# EasyEDA schematic LcsNodes-Building-Block-Power-Supply-LM2576.json
TITLE: Power supply using LM257x; REV: 1.0; Date: 2022-09-19; Sheet: 1/1; Drawn By: helmut-f; Company: Your Company
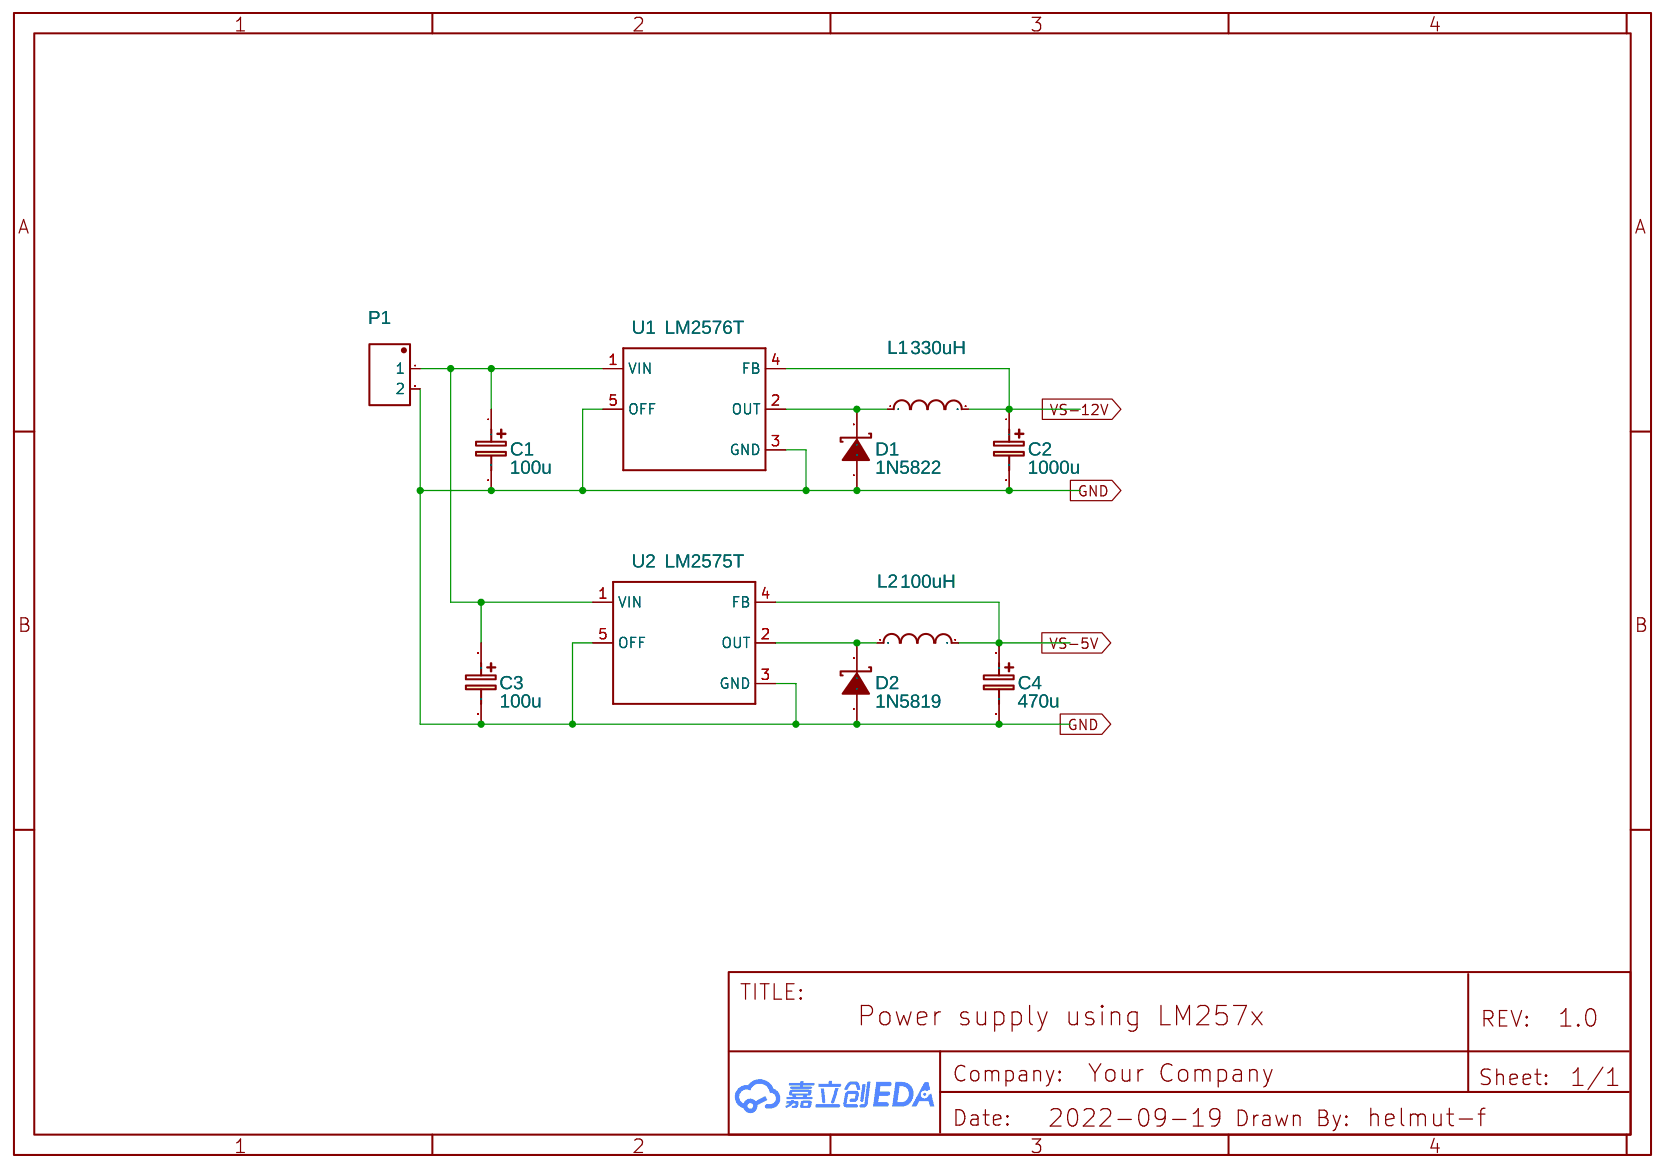
[diagram p0: schematic sheet]

## Parts
C1  100u  [CAP-D4.0×F1.5]
C2  1000u  [CAP-D4.0×F1.5]
C3  100u  [CAP-D4.0×F1.5]
C4  470u  [CAP-D4.0×F1.5]
D1  1N5822  [DO-201AD_BD5.3-L8.4-P12.50-D1.4-FD]
D2  1N5819  [DO-41_BD2.4-L4.7-P8.70-D0.9-FD]
L1  330uH  [330UH INDUCTOR]
L2  100uH  [INDUCTORS 330UH 1.1A(10*8*5MM)]
P1  Terminal_block_2P_2.54  [TERMINAL_BLOCK_0.5/2-2.54MM]
U1  LM2576T  [TO220-5]
U2  LM2575T  [TO220-5]

## Library data of the parts
C1-C4 = CE_TH_D4.0×F1.5_EU: Contributor: LCEDA_Lib
D1 = 1N5822: Supplier: LCSC; Manufacturer: MDD; image: //image.lceda.cn/szlcsc/C2476.jpg; Supplier Part: C2476; LCSC Assembly: Yes; SMT Type: Extend
D2 = 1N5819: Supplier: LCSC; Manufacturer: STMicroelectronics; Supplier Part: C110032; LCSC Assembly: Yes; SMT Type: Extend
L1 L2 = Leaded Power Inductors 330uH, 1.1A: Supplier: Element14; Manufacturer: ValuePro; Manufacturer Part: Power inductorSMRH5D28-8R2NT; LCSC: C60101; Contributor: dfgfdghgg
P1 = Terminal_block_2P_2.54: Manufacturer: Phoenix Contact; Manufacturer Part: MTP0.5/4-2.54; Supplier: Element14; Supplier Part: 3041414; link: https://www.phoenixcontact.com/online/portal/us?uri=pxc-oc-itemdetail:pid=1725672&library=usen&tab=1; Contributor: sbpk
U1 U2 = LM2576T

## Nets
Net-(C1-1): C1.1 C3.1 P1.1 U1.1(VIN) U2.1(VIN)
Net-(C1-2): C1.2 C2.2 C3.2 C4.2 D1.1(A) D2.1(A) P1.2 U1.3(GND) U1.5(OFF) U2.3(GND) U2.5(OFF)
Net-(C2-1): C2.1 L1.2 U1.4(FB)
Net-(C4-1): C4.1 L2.2 U2.4(FB)
Net-(D1-2): D1.2(K) L1.1 U1.2(OUT)
Net-(D2-2): D2.2(K) L2.1 U2.2(OUT)
